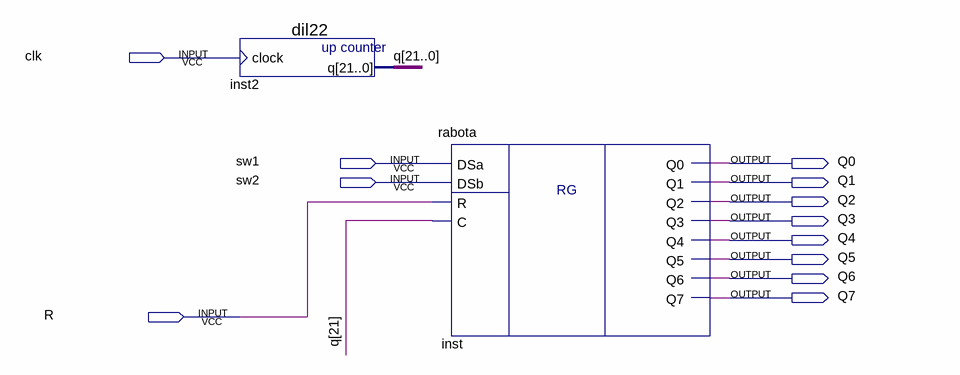
[diagram p0: schematic sheet]
// Quartus schematic Block2.bdf as structural Verilog: 2 symbols, 12 pins
module Block2 (
  input  clk,
  input  sw1,
  input  sw2,
  input  R,
  output Q0,
  output Q1,
  output Q2,
  output Q3,
  output Q4,
  output Q5,
  output Q6,
  output Q7
);

  wire [21:8] q;

  dil22 inst2 (.clock(clk), .q({q, Q7, Q6, Q5, Q4, Q3, Q2, Q1, Q0}));
  rabota inst (
    .DSa(sw1), .DSb(sw2), .R(R), .C(q[21]), .Q0(Q0), .Q1(Q1), .Q2(Q2), .Q3(Q3), .Q4(Q4), .Q5(Q5), .Q6(Q6),
    .Q7(Q7));
endmodule
